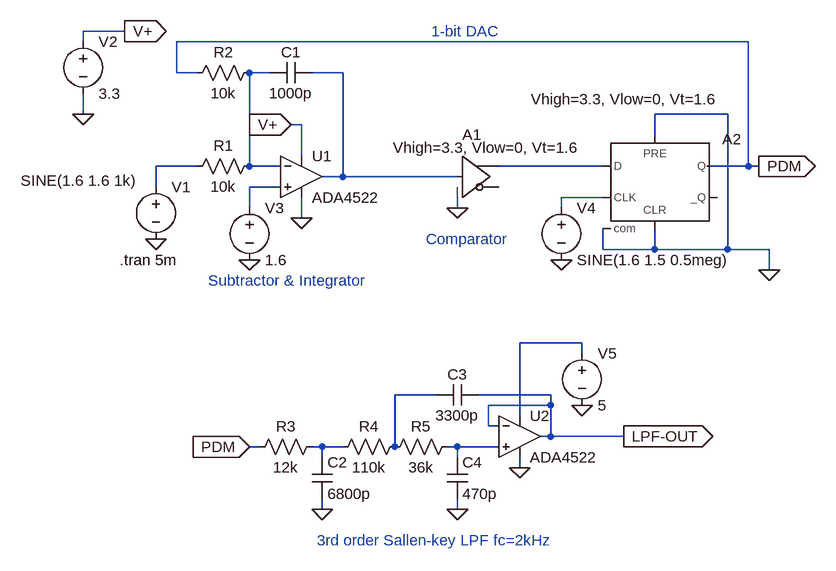
[diagram p0: schematic dsm_step3_lpf.asc]
dsm_step3_lpf.asc, the LTspice schematic file:
Version 4
SHEET 1 1752 688
WIRE 608 -112 544 -112
WIRE 544 -96 544 -112
WIRE 1568 -96 688 -96
WIRE 688 -48 688 -96
WIRE 720 -48 688 -48
WIRE 832 -48 800 -48
WIRE 944 -48 896 -48
WIRE 544 16 544 -16
WIRE 1536 16 1424 16
WIRE 880 32 864 32
WIRE 1424 48 1424 16
WIRE 880 80 880 32
WIRE 720 96 656 96
WIRE 800 96 800 -48
WIRE 848 96 800 96
WIRE 1344 96 1184 96
WIRE 1568 96 1568 -96
WIRE 1568 96 1504 96
WIRE 1584 96 1568 96
WIRE 944 112 944 -48
WIRE 944 112 912 112
WIRE 1120 112 944 112
WIRE 656 128 656 96
WIRE 848 128 800 128
WIRE 1344 144 1280 144
WIRE 800 160 800 128
WIRE 1120 160 1120 144
WIRE 1280 160 1280 144
WIRE 880 176 880 144
WIRE 1344 224 1344 192
WIRE 1424 224 1424 192
WIRE 1424 224 1344 224
WIRE 1536 224 1536 16
WIRE 1536 224 1424 224
WIRE 1600 224 1536 224
WIRE 1600 256 1600 224
WIRE 1312 368 1216 368
WIRE 1312 384 1312 368
WIRE 1088 448 1024 448
WIRE 1264 448 1152 448
WIRE 1264 464 1264 448
WIRE 1264 464 1168 464
WIRE 1216 480 1216 368
WIRE 1168 496 1168 464
WIRE 1184 496 1168 496
WIRE 1264 512 1264 464
WIRE 1264 512 1248 512
WIRE 1376 512 1264 512
WIRE 816 528 800 528
WIRE 912 528 896 528
WIRE 944 528 912 528
WIRE 1024 528 1024 448
WIRE 1120 528 1104 528
WIRE 1184 528 1120 528
WIRE 912 544 912 528
WIRE 1120 544 1120 528
WIRE 1216 560 1216 544
WIRE 912 624 912 608
WIRE 1120 624 1120 608
FLAG 656 208 0
FLAG 864 32 V+
IOPIN 864 32 In
FLAG 544 16 0
FLAG 608 -112 V+
IOPIN 608 -112 Out
FLAG 1120 160 0
FLAG 1280 240 0
FLAG 1600 256 0
FLAG 1584 96 PDM
IOPIN 1584 96 Out
FLAG 800 240 0
FLAG 880 176 0
FLAG 1312 464 0
FLAG 912 624 0
FLAG 1120 624 0
FLAG 1216 560 0
FLAG 800 528 PDM
IOPIN 800 528 In
FLAG 1376 512 LPF-OUT
IOPIN 1376 512 Out
SYMBOL voltage 656 112 R0
WINDOW 3 -208 6 Left 2
WINDOW 123 0 0 Left 0
WINDOW 39 0 0 Left 0
SYMATTR Value SINE(1.6 1.6 1k)
SYMATTR InstName V1
SYMBOL OpAmps\\ADA4522 880 48 R0
SYMATTR InstName U1
SYMBOL res 816 80 R90
WINDOW 0 0 56 VBottom 2
WINDOW 3 32 56 VTop 2
SYMATTR InstName R1
SYMATTR Value 10k
SYMBOL res 816 -64 R90
WINDOW 0 0 56 VBottom 2
WINDOW 3 32 56 VTop 2
SYMATTR InstName R2
SYMATTR Value 10k
SYMBOL cap 896 -64 R90
WINDOW 0 0 32 VBottom 2
WINDOW 3 32 32 VTop 2
SYMATTR InstName C1
SYMATTR Value 1000p
SYMBOL voltage 544 -112 R0
WINDOW 123 0 0 Left 0
WINDOW 39 0 0 Left 0
SYMATTR InstName V2
SYMATTR Value 3.3
SYMBOL Digital\\buf 1120 48 R0
WINDOW 0 8 -1 Left 2
WINDOW 3 -99 19 Left 2
SYMATTR InstName A1
SYMATTR Value Vhigh=3.3, Vlow=0, Vt=1.6
SYMBOL Digital\\dflop 1424 48 R0
WINDOW 3 -191 -55 Left 2
SYMATTR Value Vhigh=3.3, Vlow=0, Vt=1.6
SYMATTR InstName A2
SYMBOL voltage 1280 144 R0
WINDOW 123 0 0 Left 0
WINDOW 39 0 0 Left 0
SYMATTR InstName V4
SYMATTR Value SINE(1.6 1.5 0.5meg)
SYMBOL voltage 800 144 R0
WINDOW 123 0 0 Left 0
WINDOW 39 0 0 Left 0
SYMATTR InstName V3
SYMATTR Value 1.6
SYMBOL res 912 512 R90
WINDOW 0 0 56 VBottom 2
WINDOW 3 32 56 VTop 2
SYMATTR InstName R3
SYMATTR Value 12k
SYMBOL cap 896 544 R0
SYMATTR InstName C2
SYMATTR Value 6800p
SYMBOL res 1040 512 R90
WINDOW 0 0 56 VBottom 2
WINDOW 3 32 56 VTop 2
SYMATTR InstName R4
SYMATTR Value 110k
SYMBOL res 1120 512 R90
WINDOW 0 0 56 VBottom 2
WINDOW 3 32 56 VTop 2
SYMATTR InstName R5
SYMATTR Value 36k
SYMBOL voltage 1312 368 R0
WINDOW 123 0 0 Left 0
WINDOW 39 0 0 Left 0
SYMATTR InstName V5
SYMATTR Value 5
SYMBOL OpAmps\\ADA4522 1216 448 R0
SYMATTR InstName U2
SYMBOL cap 1152 432 R90
WINDOW 0 0 32 VBottom 2
WINDOW 3 32 32 VTop 2
SYMATTR InstName C3
SYMATTR Value 3300p
SYMBOL cap 1104 544 R0
SYMATTR InstName C4
SYMATTR Value 470p
TEXT 736 272 Left 2 ;Subtractor & Integrator
TEXT 1072 208 Left 2 ;Comparator
TEXT 600 240 Left 2 !.tran 5m
TEXT 1080 -112 Left 2 ;1-bit DAC
TEXT 904 672 Left 2 ;3rd order Sallen-key LPF fc=2kHz

The netlist it stands for:
* dsm_step3_lpf.asc
V1 N003 0 SINE(1.6 1.6 1k)
XU1 N005 N001 V+ 0 N002 ADA4522  ; pins In+ In- V+ V- OUT
R1 N001 N003 10k
R2 N001 PDM 10k
C1 N002 N001 1000p
V2 V+ 0 3.3
A1 N002 0 0 0 0 0 N004 0 BUF Vhigh=3.3, Vlow=0, Vt=1.6
A2 N004 0 N006 0 0 0 PDM 0 DFLOP Vhigh=3.3, Vlow=0, Vt=1.6
V4 N006 0 SINE(1.6 1.5 0.5meg)
V3 N005 0 1.6
R3 N009 PDM 12k
C2 N009 0 6800p
R4 N008 N009 110k
R5 N010 N008 36k
V5 N007 0 5
XU2 N010 LPF-OUT N007 0 LPF-OUT ADA4522  ; pins In+ In- V+ V- OUT
C3 LPF-OUT N008 3300p
C4 N010 0 470p
* Subtractor & Integrator
* Comparator
.tran 5m
* 1-bit DAC
* 3rd order Sallen-key LPF fc=2kHz
.backanno
.end